# EAGLE schematic com_board (EAGLE 9.6.2)
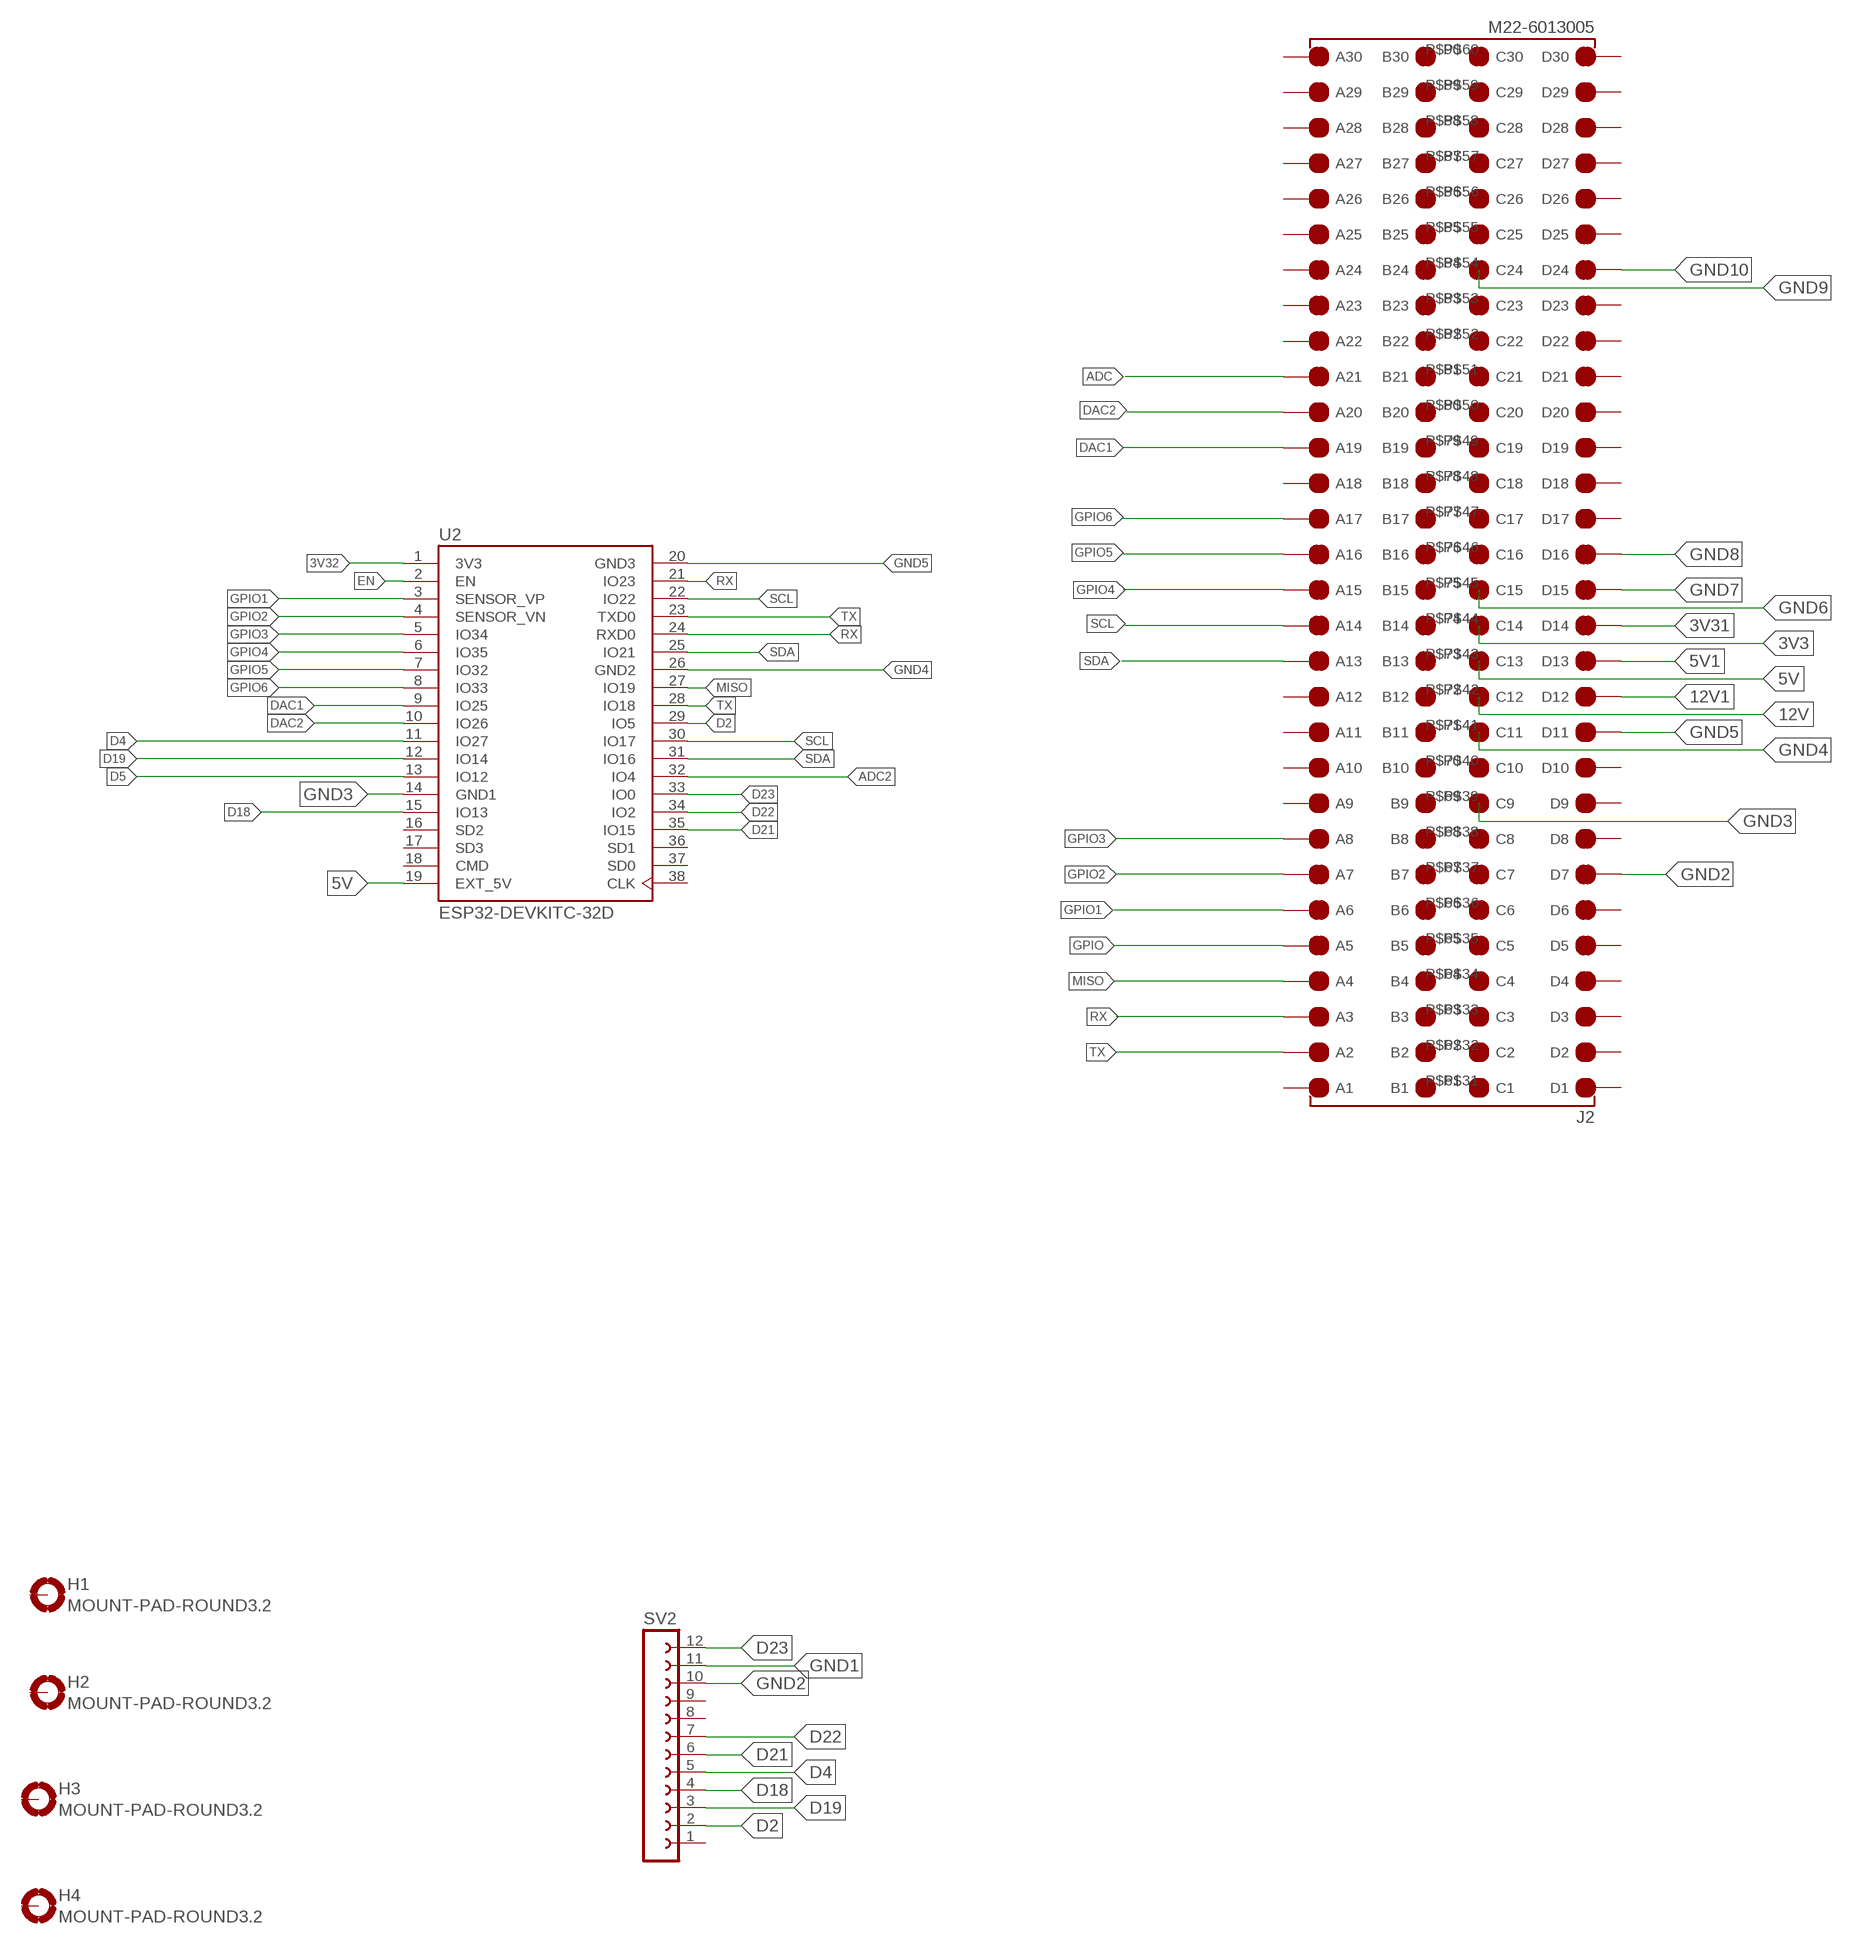
[diagram p0: schematic, sheet 1]

## Parts
H1  MOUNT-PAD-ROUND3.2  [3,2-PAD]
H2  MOUNT-PAD-ROUND3.2  [3,2-PAD]
H3  MOUNT-PAD-ROUND3.2  [3,2-PAD]
H4  MOUNT-PAD-ROUND3.2  [3,2-PAD]
J2  M22-6013005  [RHDR120W55P200_4X30_6020X820X9]
SV2  FE12-1  [FE12]
U2  ESP32-DEVKITC-32D  [MODULE_ESP32-DEVKITC-32D]

## Nets
3V3: J2.P$44(C14)
3V31: J2.P$14(D14)
3V32: U2.1(3V3)
5V: J2.P$43(C13) U2.19(EXT_5V)
5V1: J2.P$13(D13)
12V: J2.P$42(C12)
12V1: J2.P$12(D12)
ADC: J2.P$111(A21)
ADC2: U2.32(IO4)
D2: SV2.2 U2.29(IO5)
D4: SV2.5 U2.11(IO27)
D5: U2.13(IO12)
D18: SV2.4 U2.15(IO13)
D19: SV2.3 U2.12(IO14)
D21: SV2.6 U2.35(IO15)
D22: SV2.7 U2.34(IO2)
D23: SV2.12 U2.33(IO0)
DAC1: J2.P$109(A19) U2.9(IO25)
DAC2: J2.P$110(A20) U2.10(IO26)
EN: U2.2(EN)
GND1: SV2.11
GND2: J2.P$7(D7) SV2.10
GND3: J2.P$39(C9) U2.14(GND1)
GND4: J2.P$41(C11) U2.26(GND2)
GND5: J2.P$11(D11) U2.20(GND3)
GND6: J2.P$45(C15)
GND7: J2.P$15(D15)
GND8: J2.P$16(D16)
GND9: J2.P$54(C24)
GND10: J2.P$24(D24)
GPIO: J2.P$95(A5)
GPIO1: J2.P$96(A6) U2.3(SENSOR_VP)
GPIO2: J2.P$97(A7) U2.4(SENSOR_VN)
GPIO3: J2.P$98(A8) U2.5(IO34)
GPIO4: J2.P$105(A15) U2.6(IO35)
GPIO5: J2.P$106(A16) U2.7(IO32)
GPIO6: J2.P$107(A17) U2.8(IO33)
MISO: J2.P$94(A4) U2.27(IO19)
RX: J2.P$93(A3) U2.21(IO23) U2.24(RXD0)
SCL: J2.P$104(A14) U2.22(IO22) U2.30(IO17)
SDA: J2.P$103(A13) U2.25(IO21) U2.31(IO16)
TX: J2.P$92(A2) U2.23(TXD0) U2.28(IO18)
Unconnected: H1.B3,2(MOUNT) H2.B3,2(MOUNT) H3.B3,2(MOUNT) H4.B3,2(MOUNT) J2.P$1(D1) J2.P$2(D2) J2.P$3(D3) J2.P$4(D4) J2.P$5(D5) J2.P$6(D6) J2.P$8(D8) J2.P$9(D9) J2.P$10(D10) J2.P$17(D17) J2.P$18(D18) J2.P$19(D19) J2.P$20(D20) J2.P$21(D21) J2.P$22(D22) J2.P$23(D23) J2.P$25(D25) J2.P$26(D26) J2.P$27(D27) J2.P$28(D28) J2.P$29(D29) J2.P$30(D30) J2.P$31(C1) J2.P$32(C2) J2.P$33(C3) J2.P$34(C4) J2.P$35(C5) J2.P$36(C6) J2.P$37(C7) J2.P$38(C8) J2.P$40(C10) J2.P$46(C16) J2.P$47(C17) J2.P$48(C18) J2.P$49(C19) J2.P$50(C20) J2.P$51(C21) J2.P$52(C22) J2.P$53(C23) J2.P$55(C25) J2.P$56(C26) J2.P$57(C27) J2.P$58(C28) J2.P$59(C29) J2.P$60(C30) J2.P$61(B1) J2.P$62(B2) J2.P$63(B3) J2.P$64(B4) J2.P$65(B5) J2.P$66(B6) J2.P$67(B7) J2.P$68(B8) J2.P$69(B9) J2.P$70(B10) J2.P$71(B11) J2.P$72(B12) J2.P$73(B13) J2.P$74(B14) J2.P$75(B15) J2.P$76(B16) J2.P$77(B17) J2.P$78(B18) J2.P$79(B19) J2.P$80(B20) J2.P$81(B21) J2.P$82(B22) J2.P$83(B23) J2.P$84(B24) J2.P$85(B25) J2.P$86(B26) J2.P$87(B27) J2.P$88(B28) J2.P$89(B29) J2.P$90(B30) J2.P$91(A1) J2.P$99(A9) J2.P$100(A10) J2.P$101(A11) J2.P$102(A12) J2.P$108(A18) J2.P$112(A22) J2.P$113(A23) J2.P$114(A24) J2.P$115(A25) J2.P$116(A26) J2.P$117(A27) J2.P$118(A28) J2.P$119(A29) J2.P$120(A30) SV2.1 SV2.8 SV2.9 U2.16(SD2) U2.17(SD3) U2.18(CMD) U2.36(SD1) U2.37(SD0) U2.38(CLK)

## Library data of the parts
H1-H4 = holes:MOUNT-PAD-ROUND: MOUNTING PAD, round
J2 = M22-6013005:M22-6013005: HARWIN - M22-6013005 - PCB Receptacle, Board-to-Board, 2 mm, 4 Rows, 120 Contacts, Through Hole Mount, M22 Series Source: Datasheet <https://ms.componentsearchengine.com/Datasheets/2/M22-6013005.pdf>; DESCRIPTION: HARWIN - M22-6013005 - PCB Receptacle, Board-to-Board, 2 mm, 4 Rows, 120 Contacts, Through Hole Mount, M22 Series; HEIGHT: 9.65mm; MANUFACTURER_NAME: Harwin; MANUFACTURER_PART_NUMBER: M22-6013005
SV2 = con-lsta:FE12-1: FEMALE HEADER; OC_FARNELL: unknown; OC_NEWARK: unknown
U2 = ESP32-DEVKITC-32D:ESP32-DEVKITC-32D: Eval Board For Esp-Wroom-32 Check prices <https://pricing.snapeda.com/parts/ESP32-DEVKITC-32D/Espressif%20Systems/view-part?ref=eda>; AVAILABILITY: Warning; DESCRIPTION: - Transceiver; 802.11 b/g/n (Wi-Fi, WiFi, WLAN), Bluetooth® Smart Ready 4.x Dual Mode For Use With ESP-WROOM-32; MF: Espressif Systems; MP: ESP32-DEVKITC-32D; PACKAGE: None; PRICE: None; PURCHASE-URL: https://pricing.snapeda.com/search/part/ESP32-DEVKITC-32D/?ref=eda